# EasyEDA Pro project TOF_Module_v02.eprj

# Schematic Schematic1

## Sheets
1 Sensors: Board Name: Board1; Create Date: 2026-03-12; Page Name: Sensors; Project Name: TOF_Module_v02; Schematic Name: Schematic1; Update Date: 2026-03-25; Company: EasyEDA.com; Drawn: EasyEDA; Page Size: A4; Part Number: JLCPCB-002; Reviewed: EasyEDA; Version: V0.1
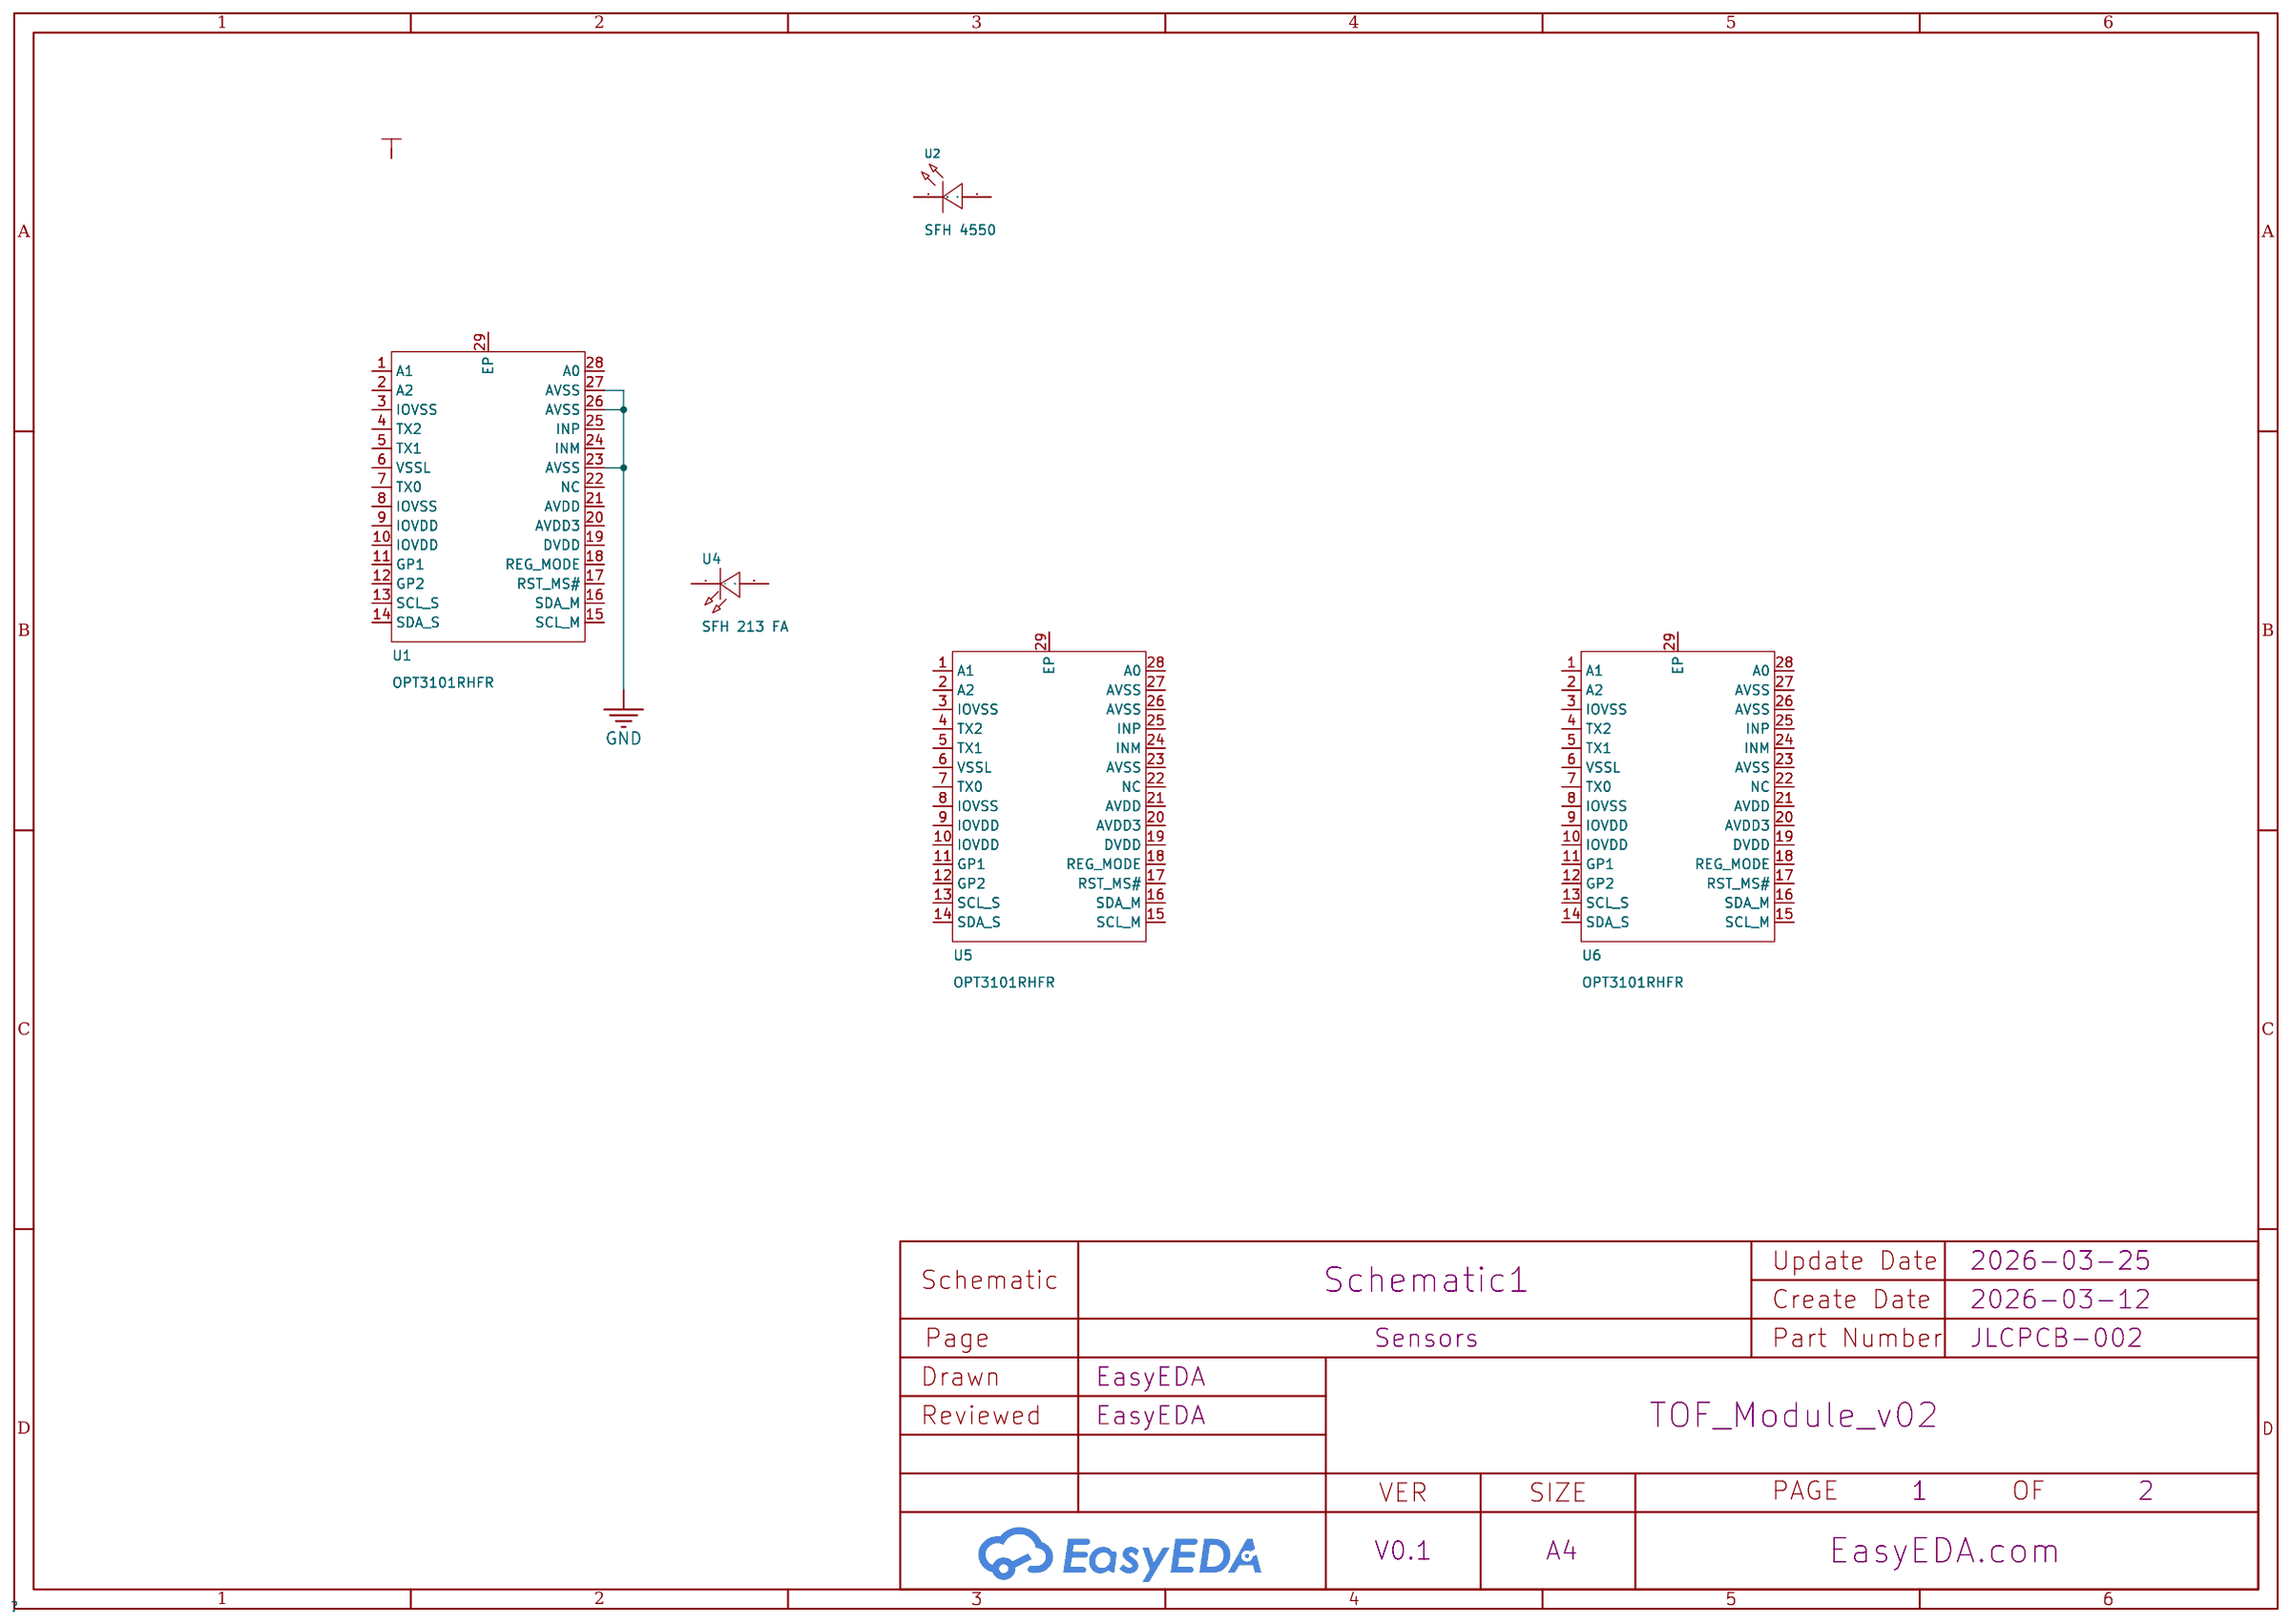
[diagram p0: Sensors]
2 Connectors: Create Date: 2026-03-25; Page Name: Connectors
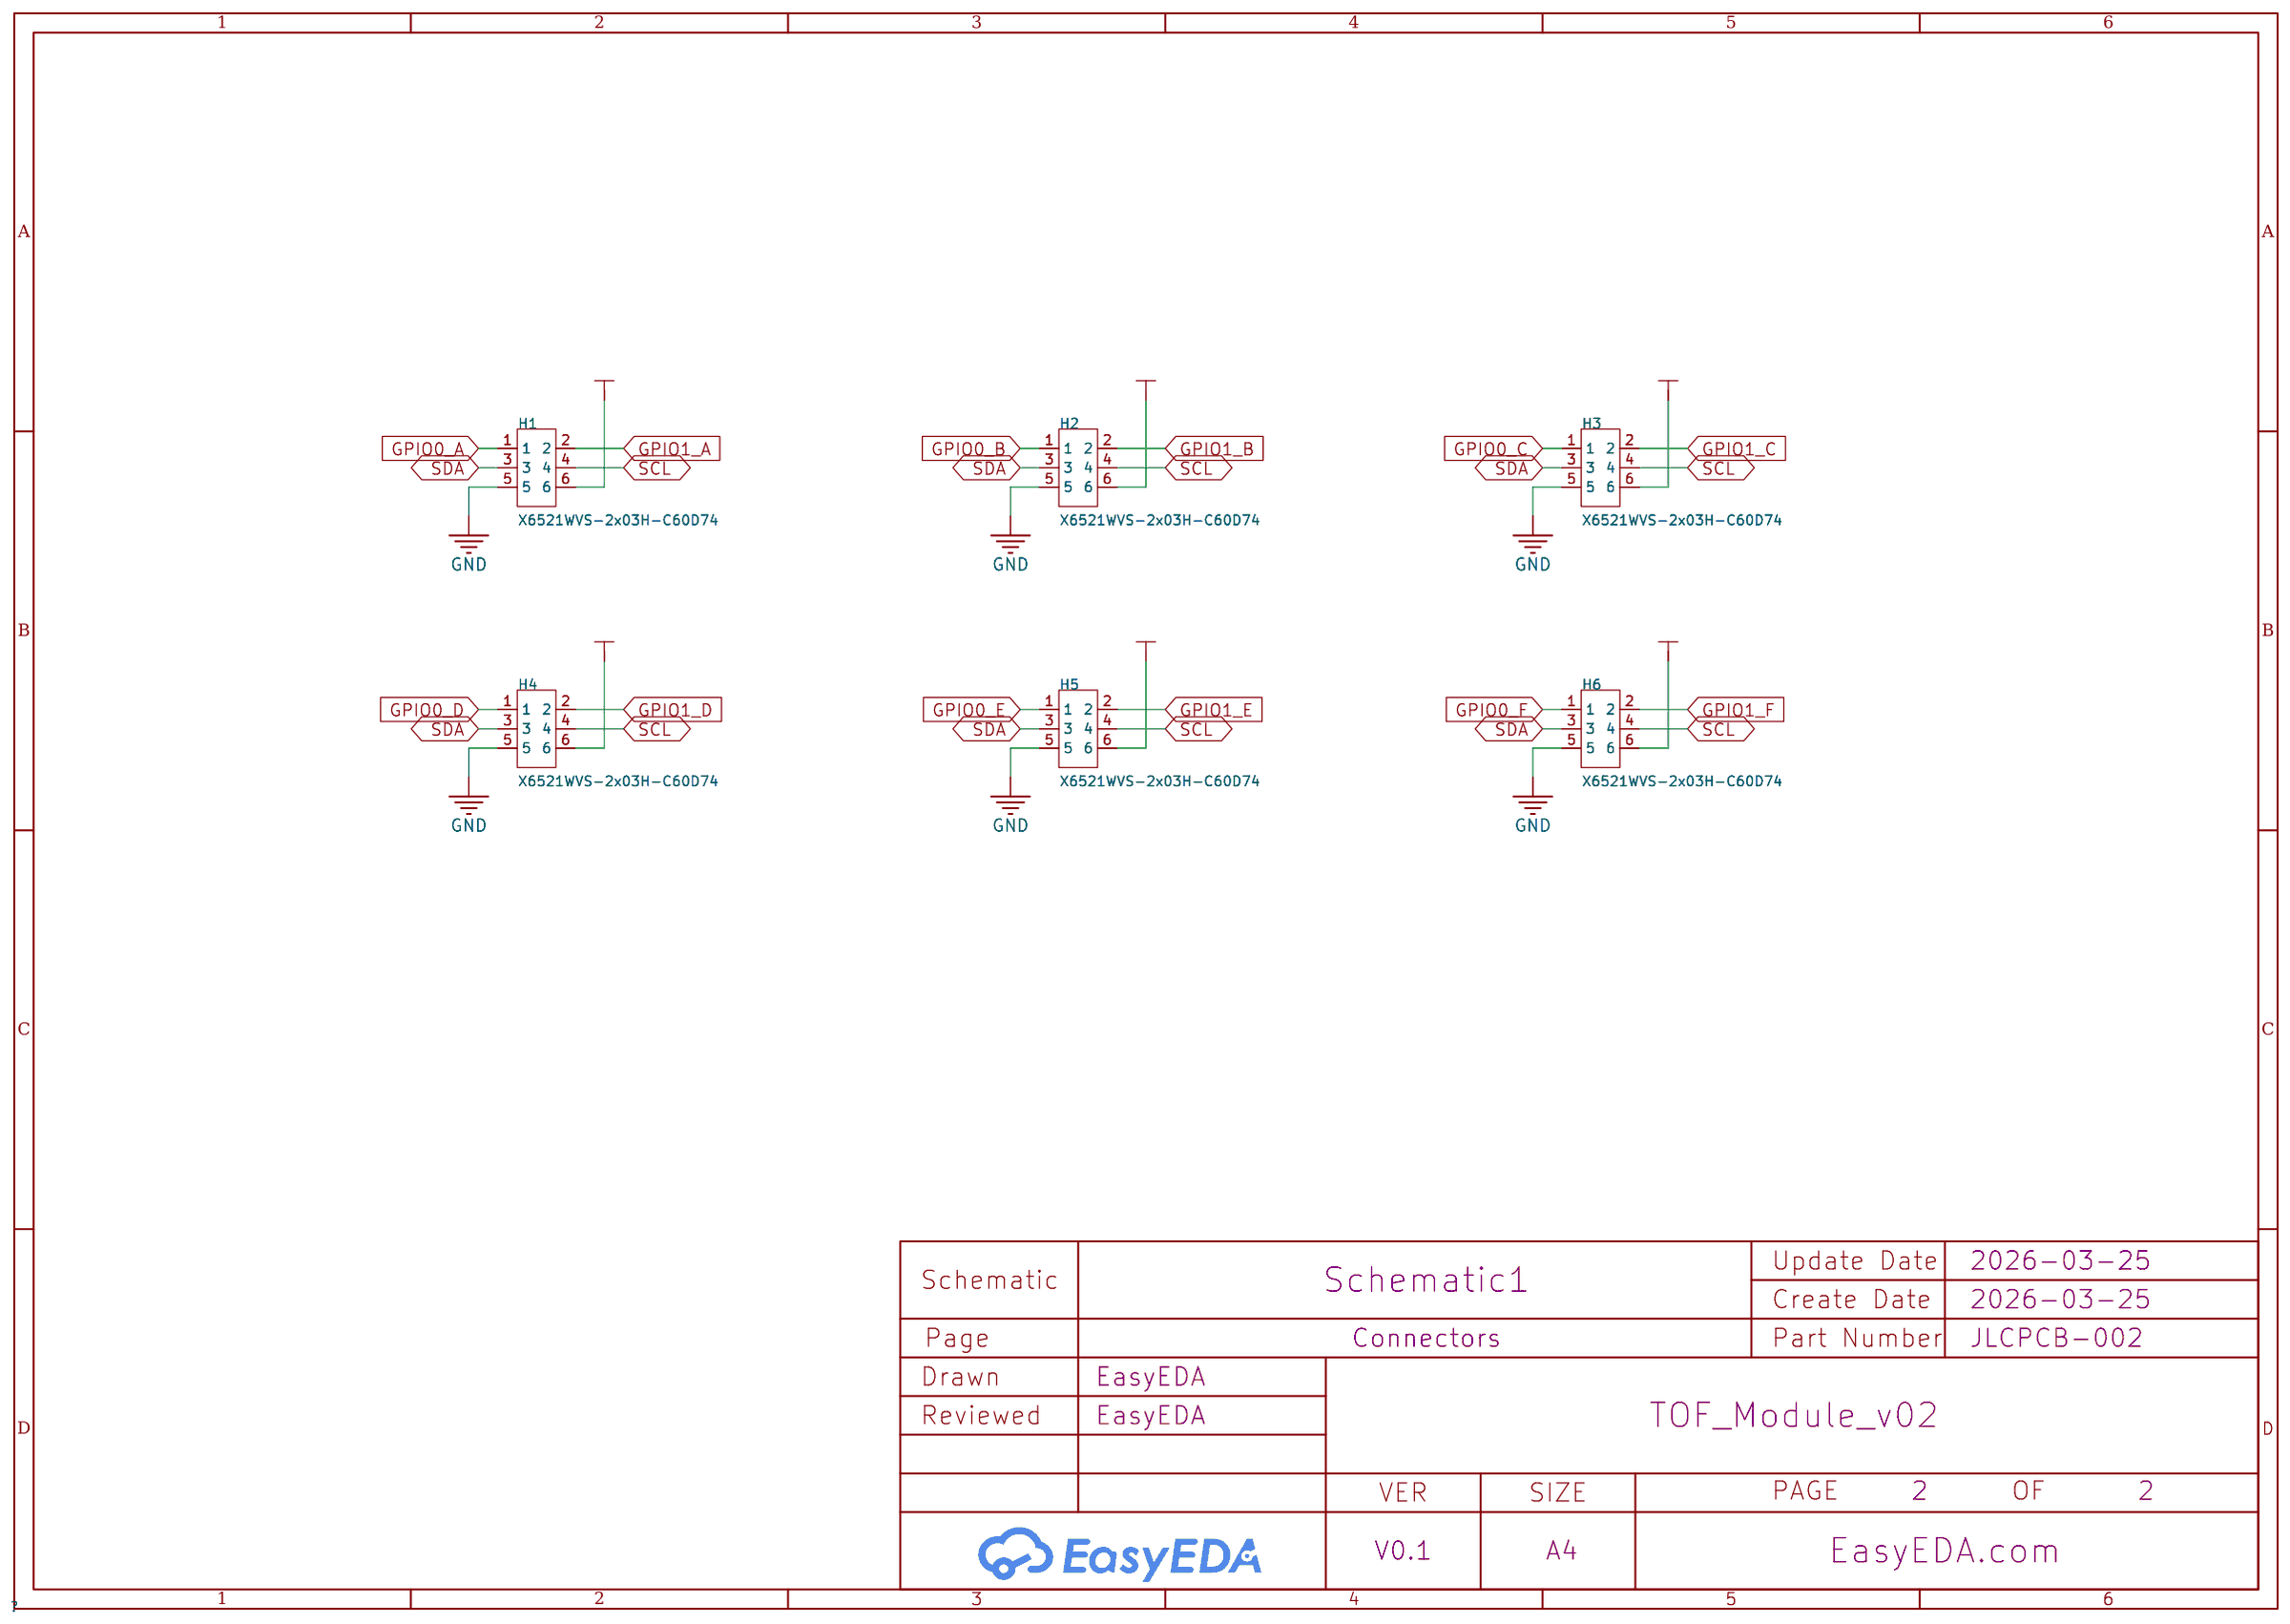
[diagram p1: Connectors]

## Parts
sheet Connectors
H1  X6521WVS-2x03H-C60D74  [HDR-SMD_6P-P2.54-V-M-R2-C5-S7.4]
H2  X6521WVS-2x03H-C60D74  [HDR-SMD_6P-P2.54-V-M-R2-C5-S7.4]
H3  X6521WVS-2x03H-C60D74  [HDR-SMD_6P-P2.54-V-M-R2-C5-S7.4]
H4  X6521WVS-2x03H-C60D74  [HDR-SMD_6P-P2.54-V-M-R2-C5-S7.4]
H5  X6521WVS-2x03H-C60D74  [HDR-SMD_6P-P2.54-V-M-R2-C5-S7.4]
H6  X6521WVS-2x03H-C60D74  [HDR-SMD_6P-P2.54-V-M-R2-C5-S7.4]
sheet Sensors
U1  OPT3101RHFR  [QFN-28_L5.0-W4.0-P0.50-BL-EP]
U2  SFH 4550  [LED-TH_BD5.9-P2.54-RD]
U4  SFH 213 FA  [OPTO-TH_BD5.8-P2.54-R-FD]
U5  OPT3101RHFR  [QFN-28_L5.0-W4.0-P0.50-BL-EP]
U6  OPT3101RHFR  [QFN-28_L5.0-W4.0-P0.50-BL-EP]

## Library data of the parts
H1-H6 = X6521WVS-2x03H-C60D74: LCSC Part Name: 2x3P 间距:2.54mm 方针; Supplier Part: C780054; Manufacturer: XKB Connection(中国星坤); Supplier Footprint: SMD,P=2.54mm; JLCPCB Part Class: Extended Part; Datasheet: https://item.szlcsc.com/datasheet/X6521WVS-2x03H-C60D74/831904.html; Supplier: LCSC; Pin Structure: 2x3P; Pitch: 2.54mm; Row Spacing: 2.54mm; Circluar Pins/Square Pins: Pin Header; Number of Rows: 2; Number of Pins: 6P; Current Rating: 3A; Voltage Rating (Max): 250V; Insulation Height: 2.5mm; Contact Material: Brass; Contact Plating: Gold; Operating Temperature: -40℃~+105℃; Color: Black
U1 U5 U6 = OPT3101RHFR: LCSC Part Name: 基于ToF的远距离接近和距离传感器AFE; Supplier Part: C2867533; Manufacturer: TI(德州仪器); Supplier Footprint: QFN-28-EP(4x5); JLCPCB Part Class: Extended Part; Datasheet: https://www.ti.com/cn/lit/gpn/opt3101; Supplier: LCSC
U2 = SFH 4550: LCSC Part Name: 光电二极管; Supplier Part: C2900376; Manufacturer: OSRAM(欧司朗); Supplier Footprint: 插件,D=5.7mm; JLCPCB Part Class: Extended Part; Datasheet: https://item.szlcsc.com/datasheet/SFH%25204550/3148303.html; Supplier: LCSC; Voltage - Forward(Vf): 1.5V; Wavelength: 860nm; Radiant Intensity: 1100mW/sr@100mA; Operating Temperature: -40℃~+100℃
U4 = SFH 213 FA: LCSC Part Name: 光电二极管; Supplier Part: C2900211; Manufacturer: OSRAM(欧司朗); Supplier Footprint: 插件,D=4.8mm; JLCPCB Part Class: Extended Part; Datasheet: https://item.szlcsc.com/datasheet/SFH%2520213%2520FA/3148138.html; Supplier: LCSC; Voltage - DC Reverse(Vr): 50V; Viewing Angle: 10°; Peak Wavelength: 900nm; Spectral Range: 750nm~1100nm; Dark Current: 1nA; Operating Temperature: -40℃~+100℃; Pd - Power Dissipation: 150mW

## Nets
3V3: H1.6 H2.6 H3.6 H4.6 H5.6 H6.6
GND: H1.5 H2.5 H3.5 H4.5 H5.5 H6.5 U1.23(AVSS) U1.26(AVSS) U1.27(AVSS)
GPIO0_A: H1.1
GPIO0_B: H2.1
GPIO0_C: H3.1
GPIO0_D: H4.1
GPIO0_E: H5.1
GPIO0_F: H6.1
GPIO1_A: H1.2
GPIO1_B: H2.2
GPIO1_C: H3.2
GPIO1_D: H4.2
GPIO1_E: H5.2
GPIO1_F: H6.2
SCL: H1.4 H2.4 H3.4 H4.4 H5.4 H6.4
SDA: H1.3 H2.3 H3.3 H4.3 H5.3 H6.3

Not connected (* = marked no-connect by the designer): U1 1(A1) 2(A2) 3(IOVSS) 4(TX2) 5(TX1) 6(VSSL) 7(TX0) 8(IOVSS) 9(IOVDD) 10(IOVDD) 11(GP1) 12(GP2) 13(SCL_S) 14(SDA_S) 15(SCL_M) 16(SDA_M) 17(RST_MS#) 18(REG_MODE) 19(DVDD) 20(AVDD3) 21(AVDD) 22(NC) 24(INM) 25(INP) 28(A0) 29(EP); U2 1 2; U4 1(-) 2(+); U5 1(A1) 2(A2) 3(IOVSS) 4(TX2) 5(TX1) 6(VSSL) 7(TX0) 8(IOVSS) 9(IOVDD) 10(IOVDD) 11(GP1) 12(GP2) 13(SCL_S) 14(SDA_S) 15(SCL_M) 16(SDA_M) 17(RST_MS#) 18(REG_MODE) 19(DVDD) 20(AVDD3) 21(AVDD) 22(NC) 23(AVSS) 24(INM) 25(INP) 26(AVSS) 27(AVSS) 28(A0) 29(EP); U6 1(A1) 2(A2) 3(IOVSS) 4(TX2) 5(TX1) 6(VSSL) 7(TX0) 8(IOVSS) 9(IOVDD) 10(IOVDD) 11(GP1) 12(GP2) 13(SCL_S) 14(SDA_S) 15(SCL_M) 16(SDA_M) 17(RST_MS#) 18(REG_MODE) 19(DVDD) 20(AVDD3) 21(AVDD) 22(NC) 23(AVSS) 24(INM) 25(INP) 26(AVSS) 27(AVSS) 28(A0) 29(EP)
